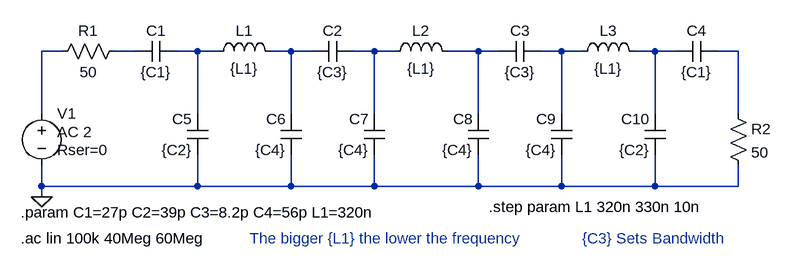
[diagram p0: schematic BandPass50M_5.asc]
BandPass50M_5.asc, the LTspice schematic file:
Version 4
SHEET 1 880 680
WIRE -2592 80 -2624 80
WIRE -2480 80 -2512 80
WIRE -2384 80 -2416 80
WIRE -2352 80 -2384 80
WIRE -2240 80 -2272 80
WIRE -2208 80 -2240 80
WIRE -2112 80 -2144 80
WIRE -2080 80 -2112 80
WIRE -1952 80 -2000 80
WIRE -1920 80 -1952 80
WIRE -1824 80 -1856 80
WIRE -1792 80 -1824 80
WIRE -1680 80 -1712 80
WIRE -1648 80 -1680 80
WIRE -1552 80 -1584 80
WIRE -2624 176 -2624 80
WIRE -2384 176 -2384 80
WIRE -2240 176 -2240 80
WIRE -2112 176 -2112 80
WIRE -1952 176 -1952 80
WIRE -1824 176 -1824 80
WIRE -1680 176 -1680 80
WIRE -1552 176 -1552 80
WIRE -2624 288 -2624 256
WIRE -2384 288 -2384 240
WIRE -2384 288 -2624 288
WIRE -2240 288 -2240 240
WIRE -2240 288 -2384 288
WIRE -2112 288 -2112 240
WIRE -2112 288 -2240 288
WIRE -1952 288 -1952 240
WIRE -1952 288 -2112 288
WIRE -1824 288 -1824 240
WIRE -1824 288 -1952 288
WIRE -1680 288 -1680 240
WIRE -1680 288 -1824 288
WIRE -1552 288 -1552 256
WIRE -1552 288 -1680 288
WIRE -2624 304 -2624 288
FLAG -2624 304 0
SYMBOL ind -2368 96 R270
WINDOW 0 32 56 VTop 2
WINDOW 3 5 56 VBottom 2
SYMATTR InstName L1
SYMATTR Value {L1}
SYMBOL voltage -2624 160 R0
WINDOW 3 24 44 Left 2
WINDOW 123 24 44 Left 2
WINDOW 39 24 72 Left 2
SYMATTR Value ""
SYMATTR Value2 AC 2
SYMATTR SpiceLine Rser=0
SYMATTR InstName V1
SYMBOL cap -2416 64 R90
WINDOW 0 0 32 VBottom 2
WINDOW 3 32 32 VTop 2
SYMATTR InstName C1
SYMATTR Value {C1}
SYMBOL res -2608 96 R270
WINDOW 0 32 56 VTop 2
WINDOW 3 0 56 VBottom 2
SYMATTR InstName R1
SYMATTR Value 50
SYMBOL cap -2368 240 R180
WINDOW 0 24 56 Left 2
WINDOW 3 24 8 Left 2
SYMATTR InstName C5
SYMATTR Value {C2}
SYMBOL cap -2144 64 R90
WINDOW 0 0 32 VBottom 2
WINDOW 3 32 32 VTop 2
SYMATTR InstName C2
SYMATTR Value {C3}
SYMBOL cap -2224 240 R180
WINDOW 0 24 56 Left 2
WINDOW 3 24 8 Left 2
SYMATTR InstName C6
SYMATTR Value {C4}
SYMBOL ind -2096 96 R270
WINDOW 0 32 56 VTop 2
WINDOW 3 5 56 VBottom 2
SYMATTR InstName L2
SYMATTR Value {L1}
SYMBOL cap -2096 240 R180
WINDOW 0 24 56 Left 2
WINDOW 3 24 8 Left 2
SYMATTR InstName C7
SYMATTR Value {C4}
SYMBOL cap -1936 240 R180
WINDOW 0 24 56 Left 2
WINDOW 3 24 8 Left 2
SYMATTR InstName C8
SYMATTR Value {C4}
SYMBOL cap -1856 64 R90
WINDOW 0 0 32 VBottom 2
WINDOW 3 32 32 VTop 2
SYMATTR InstName C3
SYMATTR Value {C3}
SYMBOL ind -1808 96 R270
WINDOW 0 32 56 VTop 2
WINDOW 3 5 56 VBottom 2
SYMATTR InstName L3
SYMATTR Value {L1}
SYMBOL cap -1808 240 R180
WINDOW 0 24 56 Left 2
WINDOW 3 24 8 Left 2
SYMATTR InstName C9
SYMATTR Value {C4}
SYMBOL cap -1664 240 R180
WINDOW 0 24 56 Left 2
WINDOW 3 24 8 Left 2
SYMATTR InstName C10
SYMATTR Value {C2}
SYMBOL cap -1584 64 R90
WINDOW 0 0 32 VBottom 2
WINDOW 3 32 32 VTop 2
SYMATTR InstName C4
SYMATTR Value {C1}
SYMBOL res -1568 160 R0
SYMATTR InstName R2
SYMATTR Value 50
TEXT -2656 368 Left 2 !.ac lin 100k 40Meg 60Meg
TEXT -2656 328 Left 2 !.param C1=27p C2=39p C3=8.2p C4=56p L1=320n
TEXT -1936 320 Left 2 !.step param L1 320n 330n 10n
TEXT -1792 368 Left 2 ;{C3} Sets Bandwidth
TEXT -2304 368 Left 2 ;The bigger {L1} the lower the frequency

The netlist it stands for:
* BandPass50M_5.asc
L1 N003 N004 {L1}
V1 N001 0 AC 2 Rser=0
C1 N003 N002 {C1}
R1 N001 N002 50
C5 0 N003 {C2}
C2 N005 N004 {C3}
C6 0 N004 {C4}
L2 N005 N006 {L1}
C7 0 N005 {C4}
C8 0 N006 {C4}
C3 N007 N006 {C3}
L3 N007 N008 {L1}
C9 0 N007 {C4}
C10 0 N008 {C2}
C4 N009 N008 {C1}
R2 N009 0 50
.ac lin 100k 40Meg 60Meg
.param C1=27p C2=39p C3=8.2p C4=56p L1=320n
.step param L1 320n 330n 10n
* {C3} Sets Bandwidth
* The bigger {L1} the lower the frequency
.backanno
.end